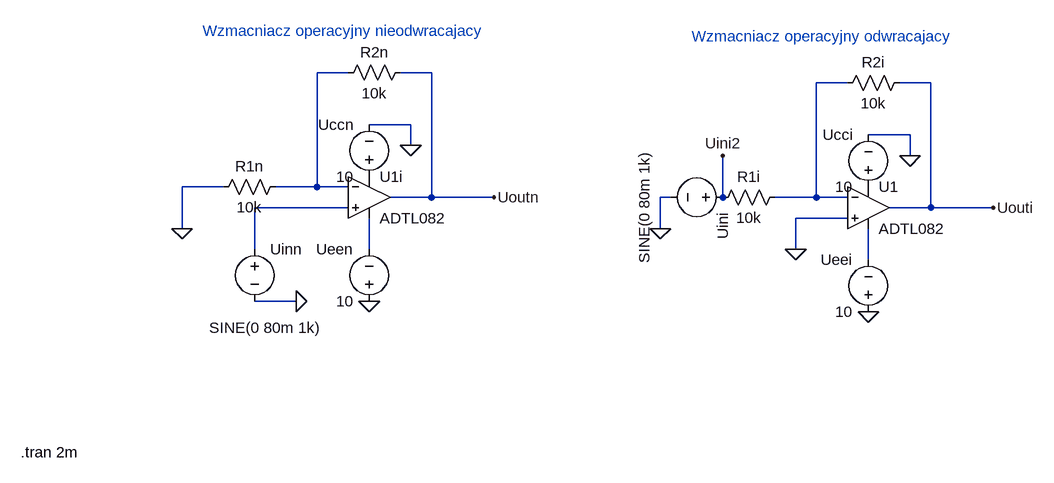
[diagram p0: schematic pd_z1.asc]
pd_z1.asc, the LTspice schematic file:
Version 4
SHEET 1 880 680
WIRE -416 80 -464 80
WIRE -288 80 -336 80
WIRE 352 96 304 96
WIRE 480 96 432 96
WIRE -320 160 -384 160
WIRE 448 176 384 176
WIRE -320 192 -320 160
WIRE 448 208 448 176
WIRE -608 256 -672 256
WIRE -464 256 -464 80
WIRE -464 256 -528 256
WIRE -416 256 -464 256
WIRE -288 272 -288 80
WIRE -288 272 -352 272
WIRE -192 272 -288 272
WIRE 80 272 64 272
WIRE 160 272 160 208
WIRE 304 272 304 96
WIRE 304 272 240 272
WIRE 352 272 304 272
WIRE -416 288 -560 288
WIRE 480 288 480 96
WIRE 480 288 416 288
WIRE 576 288 480 288
WIRE 352 304 272 304
WIRE -672 320 -672 256
WIRE 64 320 64 272
WIRE -560 352 -560 288
WIRE -384 352 -384 304
WIRE 272 352 272 304
WIRE 384 368 384 320
WIRE -496 432 -560 432
FLAG -672 320 0
FLAG -496 432 0
FLAG -384 432 0
FLAG -320 192 0
FLAG -192 272 Uoutn
FLAG 384 448 0
FLAG 448 208 0
FLAG 576 288 Uouti
FLAG 64 320 0
FLAG 272 352 0
FLAG 160 208 Uini2
SYMBOL OpAmps\\ADTL082 -384 208 R0
SYMATTR InstName U1i
SYMBOL res -512 240 R90
WINDOW 0 0 56 VBottom 2
WINDOW 3 32 56 VTop 2
SYMATTR InstName R1n
SYMATTR Value 10k
SYMBOL res -320 64 R90
WINDOW 0 0 56 VBottom 2
WINDOW 3 32 56 VTop 2
SYMATTR InstName R2n
SYMATTR Value 10k
SYMBOL voltage -560 336 R0
WINDOW 3 -70 137 Left 2
WINDOW 123 0 0 Left 0
WINDOW 39 0 0 Left 0
SYMATTR Value SINE(0 80m 1k)
SYMATTR InstName Uinn
SYMBOL voltage -384 448 R180
WINDOW 0 24 96 Left 2
WINDOW 3 24 16 Left 2
SYMATTR InstName Ueen
SYMATTR Value 10
SYMBOL voltage -384 256 R180
WINDOW 0 24 96 Left 2
WINDOW 3 24 16 Left 2
SYMATTR InstName Uccn
SYMATTR Value 10
SYMBOL OpAmps\\ADTL082 384 224 R0
SYMATTR InstName U1
SYMBOL res 256 256 R90
WINDOW 0 0 56 VBottom 2
WINDOW 3 32 56 VTop 2
SYMATTR InstName R1i
SYMATTR Value 10k
SYMBOL res 448 80 R90
WINDOW 0 0 56 VBottom 2
WINDOW 3 32 56 VTop 2
SYMATTR InstName R2i
SYMATTR Value 10k
SYMBOL voltage 176 272 R90
WINDOW 3 -70 137 Left 2
WINDOW 123 0 0 Left 0
WINDOW 39 0 0 Left 0
SYMATTR Value SINE(0 80m 1k)
SYMATTR InstName Uini
SYMBOL voltage 384 464 R180
WINDOW 0 24 96 Left 2
WINDOW 3 24 16 Left 2
SYMATTR InstName Ueei
SYMATTR Value 10
SYMBOL voltage 384 272 R180
WINDOW 0 24 96 Left 2
WINDOW 3 24 16 Left 2
SYMATTR InstName Ucci
SYMATTR Value 10
TEXT -640 16 Left 2 ;Wzmacniacz operacyjny nieodwracajacy
TEXT -920 664 Left 2 !.tran 2m
TEXT 112 24 Left 2 ;Wzmacniacz operacyjny odwracajacy

The netlist it stands for:
* pd_z1.asc
XU1i N003 N001 P001 N004 Uoutn ADTL082  ; pins In+ In- V+ V- OUT
R1n N001 0 10k
R2n Uoutn N001 10k
V§Uinn N003 0 SINE(0 80m 1k)
V§Ueen 0 N004 10
V§Uccn P001 0 10
XU1 0 N002 P002 N005 Uouti ADTL082  ; pins In+ In- V+ V- OUT
R1i N002 Uini2 10k
R2i Uouti N002 10k
V§Uini Uini2 0 SINE(0 80m 1k)
V§Ueei 0 N005 10
V§Ucci P002 0 10
* Wzmacniacz operacyjny nieodwracajacy
.tran 2m
* Wzmacniacz operacyjny odwracajacy
.lib ADI.lib
.backanno
.end